# EAGLE schematic telemetrics (EAGLE 6.1)
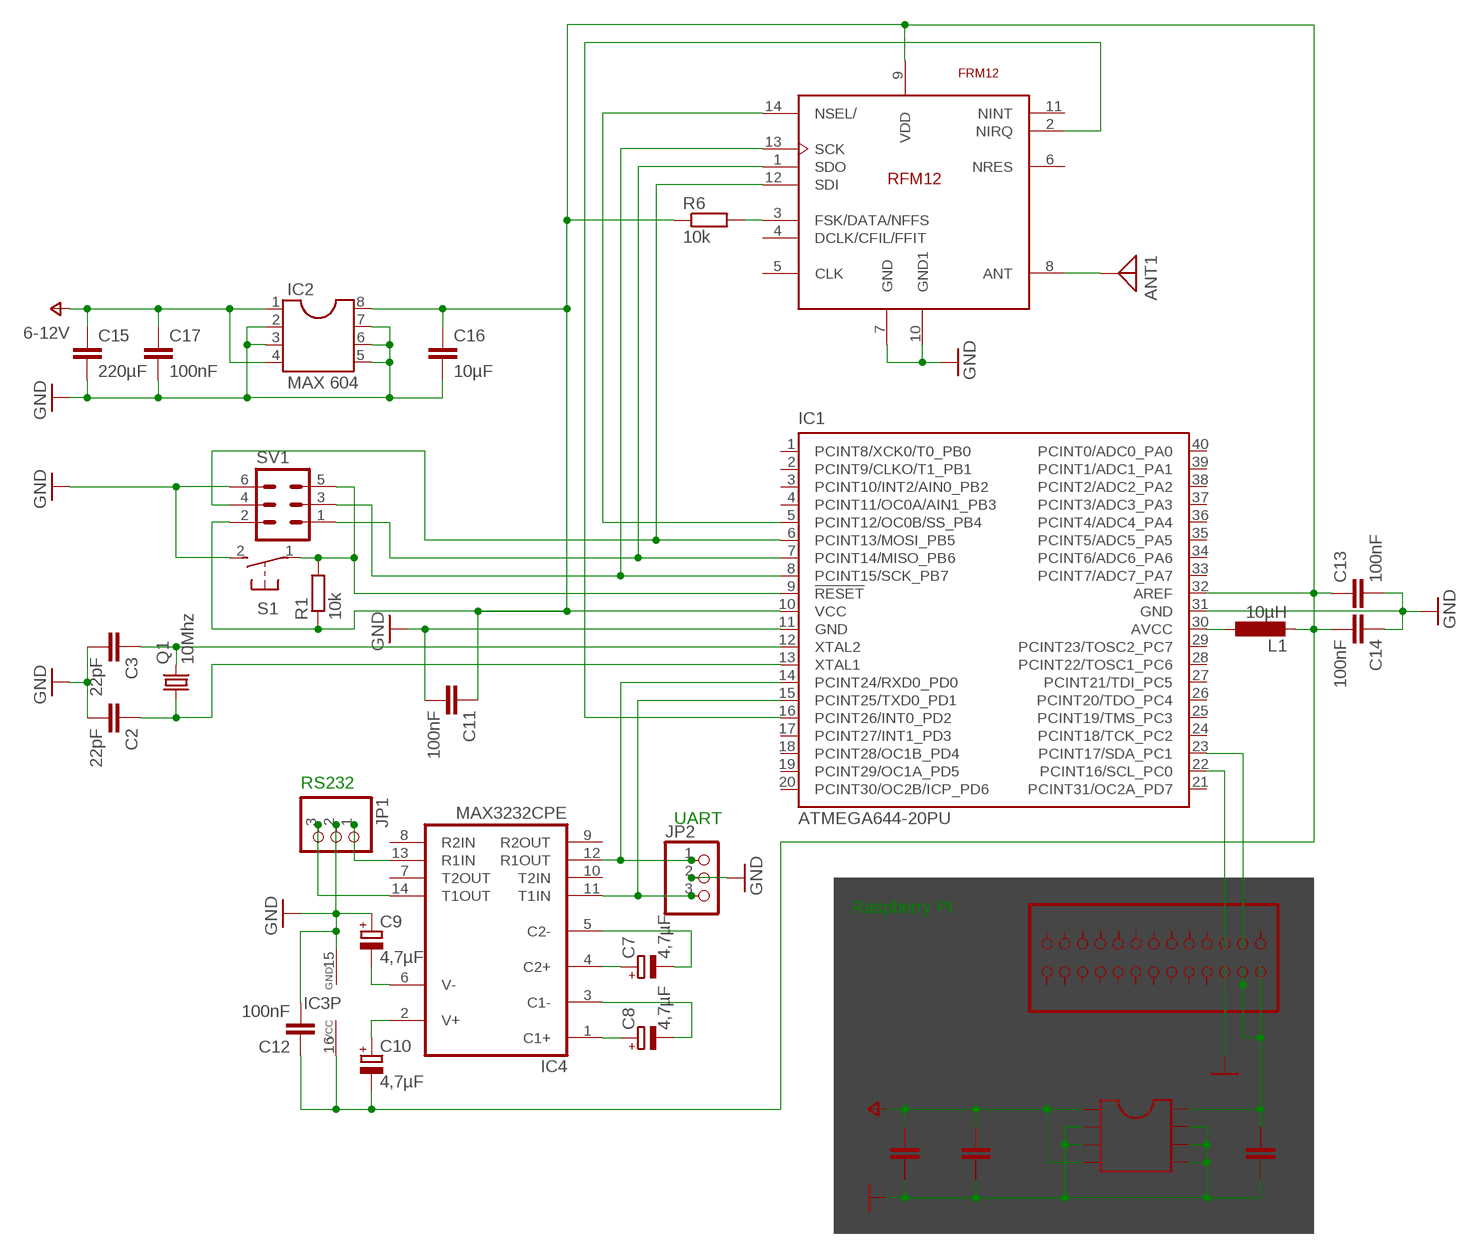
[diagram p0: schematic, sheet 1]

## Parts
ANT1  ANTENNA  [PAD-01]
C1  220µF  C2.5/6  [C2.5-6]
C2  22pF  C2.5/6  [C2.5-6]
C3  22pF  C2.5/6  [C2.5-6]
C4  10µF  C2.5/5  [C2.5-5]
C5  100nF  C2.5/2  [C2.5-2]
C7  4,7µF  CPOL-EUE2,5-6E  [E2,5-6E]
C8  4,7µF  CPOL-EUE2,5-6E  [E2,5-6E]
C9  4,7µF  CPOL-EUE2,5-6E  [E2,5-6E]
C10  4,7µF  CPOL-EUE2,5-6E  [E2,5-6E]
C11  100nF  C2.5/6  [C2.5-6]
C12  100nF  C2.5/6  [C2.5-6]
C13  100nF  C2.5/6  [C2.5-6]
C14  100nF  C2.5/6  [C2.5-6]
C15  220µF  C2.5/6  [C2.5-6]
C16  10µF  C2.5/5  [C2.5-5]
C17  100nF  C2.5/2  [C2.5-2]
IC1  ATMEGA644-20PU  [DIL40]
IC2  MAX 604  DIL8S  [SOCKET-08]
IC3  MAX232  [DIL16]
IC4  MAX3232CPE  [DIL16]
IC5  MAX 603  DIL8S  [SOCKET-08]
JP1  PINHD-1X3  [1X03]
JP2  PINHD-1X3  [1X03]
JP3  Raspberry GPIO  PINHD-2X13  [2X13]
L1  10µH  L-EUIRF-3  [IRF-3]
Q1  10Mhz  CRYSTALHC49U70  [HC49U70]
R1  10k  R-EU_0207/10  [0207/10]
R6  10k  R-EU_0207/10  [0207/10]
S1  31-XX  [B3F-31XX]
SV1  ML6  [ML6]
U$2  FRM12  [RFM12]

## Nets
GND: C1.2 C2.2 C3.2 C4.2 C5.2 C9.+ C11.2 C12.2 C13.2 C14.1 C15.2 C16.2 C17.2 IC1.11(GND) IC1.31(GND) IC2.2 IC2.3 IC2.5 IC2.6 IC2.7 IC3.15(GND) IC5.2 IC5.3 IC5.5 IC5.6 IC5.7 JP1.2 JP2.2 JP3.6 S1.2(S) SV1.6 U$2.7(GND) U$2.10(GND1)
N$1: C2.1 IC1.13(XTAL1) Q1.1
N$2: C7.- IC4.5(C2-)
N$3: IC1.9(!RESET) R1.2 S1.1(P) SV1.5
N$4: IC1.30(AVCC) L1.1
N$5: IC1.7(PCINT14/MISO_PB6) SV1.1 U$2.1(SDO)
N$6: IC1.8(PCINT15/SCK_PB7) SV1.3 U$2.13(SCK)
N$7: C8.- IC4.3(C1-)
N$8: C10.+ IC4.2(V+)
N$9: C7.+ IC4.4(C2+)
N$10: IC1.6(PCINT13/MOSI_PB5) SV1.4 U$2.12(SDI)
N$11: C8.+ IC4.1(C1+)
N$12: ANT1.1 U$2.8(ANT)
N$13: IC1.5(PCINT12/OC0B/SS_PB4) U$2.14(NSEL/)
N$14: IC1.16(PCINT26/INT0_PD2) U$2.2(NIRQ)
N$15: R6.2 U$2.3(FSK/DATA/NFFS)
N$16: C9.- IC4.6(V-)
N$17: IC4.14(T1OUT) JP1.3
N$18: C3.1 IC1.12(XTAL2) Q1.2
N$19: IC1.14(PCINT24/RXD0_PD0) IC4.12(R1OUT) JP2.1
N$20: IC1.15(PCINT25/TXD0_PD1) IC4.11(T1IN) JP2.3
N$21: IC1.23(PCINT17/SDA_PC1) JP3.3
N$22: IC1.22(PCINT16/SCL_PC0) JP3.5
RS232: IC4.13(R1IN) JP1.1
V+: C1.1 C5.1 C15.1 C17.1 IC2.1 IC2.4 IC5.1 IC5.4 ; supply symbol labelled 6-12V
VDD: C10.- C11.1 C12.1 C13.1 C14.2 C16.1 IC1.10(VCC) IC1.32(AREF) IC2.8 IC3.16(VCC) L1.2 R1.1 R6.1 SV1.2 U$2.9(VDD)
VDD1: C4.1 IC5.8 JP3.2 JP3.4
Unconnected: IC1.1(PCINT8/XCK0/T0_PB0) IC1.2(PCINT9/CLKO/T1_PB1) IC1.3(PCINT10/INT2/AIN0_PB2) IC1.4(PCINT11/OC0A/AIN1_PB3) IC1.17(PCINT27/INT1_PD3) IC1.18(PCINT28/OC1B_PD4) IC1.19(PCINT29/OC1A_PD5) IC1.20(PCINT30/OC2B/ICP_PD6) IC1.21(PCINT31/OC2A_PD7) IC1.24(PCINT18/TCK_PC2) IC1.25(PCINT19/TMS_PC3) IC1.26(PCINT20/TDO_PC4) IC1.27(PCINT21/TDI_PC5) IC1.28(PCINT22/TOSC1_PC6) IC1.29(PCINT23/TOSC2_PC7) IC1.33(PCINT7/ADC7_PA7) IC1.34(PCINT6/ADC6_PA6) IC1.35(PCINT5/ADC5_PA5) IC1.36(PCINT4/ADC4_PA4) IC1.37(PCINT3/ADC3_PA3) IC1.38(PCINT2/ADC2_PA2) IC1.39(PCINT1/ADC1_PA1) IC1.40(PCINT0/ADC0_PA0) IC3.1(C1+) IC3.2(V+) IC3.3(C1-) IC3.4(C2+) IC3.5(C2-) IC3.6(V-) IC3.7(T2OUT) IC3.8(R2IN) IC3.9(R2OUT) IC3.10(T2IN) IC3.11(T1IN) IC3.12(R1OUT) IC3.13(R1IN) IC3.14(T1OUT) IC4.7(T2OUT) IC4.8(R2IN) IC4.9(R2OUT) IC4.10(T2IN) JP3.1 JP3.7 JP3.8 JP3.9 JP3.10 JP3.11 JP3.12 JP3.13 JP3.14 JP3.15 JP3.16 JP3.17 JP3.18 JP3.19 JP3.20 JP3.21 JP3.22 JP3.23 JP3.24 JP3.25 JP3.26 U$2.4(DCLK/CFIL/FFIT) U$2.5(CLK) U$2.6(NRES) U$2.11(NINT)

## Notes on the sheet
- RS232
- UART
- Raspberry PI

## Power pins joined to a net without a drawn wire
GND: IC4.15(GND)
VCC: IC4.16(VCC)

## Library data of the parts
ANT1 = discrete:ANTENNA: Antenna
C1-C5 C11-C17 = capacitor-wima:C: CAPACITOR naming: grid - package width
C7-C10 = rcl:CPOL-EU: POLARIZED CAPACITOR, European symbol
IC1 = atmel:ATMEGA644-*PU: 8-bit Microcontroller with 64K Bytes In-System Programmable Flash Auto generated by make-symbol-device-package-bsdl.ulp Rev. 34 Source: http://www.atmel.com/dyn/resources/prod_documents/doc2593.pdf; MPN: ATMEGA644-20PU; OC_FARNELL: 1288340; OC_NEWARK: 23M5060
IC2 IC5 = ic-package:DIL8: Dual In Line / Socket
IC3 = maxim:MAX232: RS232 TRANSEIVER; MF: MAXIM; MPN: MAX232ACPE+; OC_FARNELL: 9723773; OC_NEWARK: 68K4544
IC4 = maxim:MAX3232*: True RS-232 Transceivers 3.0V to 5.5V, Low-Power up to 1Mbps, Using Four 0.1µF External Capacitors Source: http://pdfserv.maxim-ic.com/en/ds/MAX3222-MAX3241.pdf; MF: MAXIM; MPN: MAX3232CPE+; OC_FARNELL: 9724494; OC_NEWARK: 68K4626
JP1 JP2 = pinhead:PINHD-1X3: PIN HEADER
JP3 = pinhead:PINHD-2X13: PIN HEADER
L1 = rcl:L-EU: INDUCTOR, European symbol
Q1 = crystal:CRYSTAL: CRYSTAL; OC_FARNELL: unknown; OC_NEWARK: unknown
R1 R6 = resistor:R-EU_: RESISTOR, European symbol
S1 = switch-omron:31-XX: OMRON SWITCH; MPN: B3F-3100; OC_FARNELL: 959704; OC_NEWARK: 36M3582
SV1 = con-ml:ML6: HARTING; OC_FARNELL: unknown; OC_NEWARK: unknown
U$2 = RFM12:FRM12